# EasyEDA schematic glowstick_schematic.json
TITLE: Sheet_1; REV: 1.0; Date: 2022-10-23; Sheet: 1/1; Drawn By: robert.f.dougherty; Company: Your Company
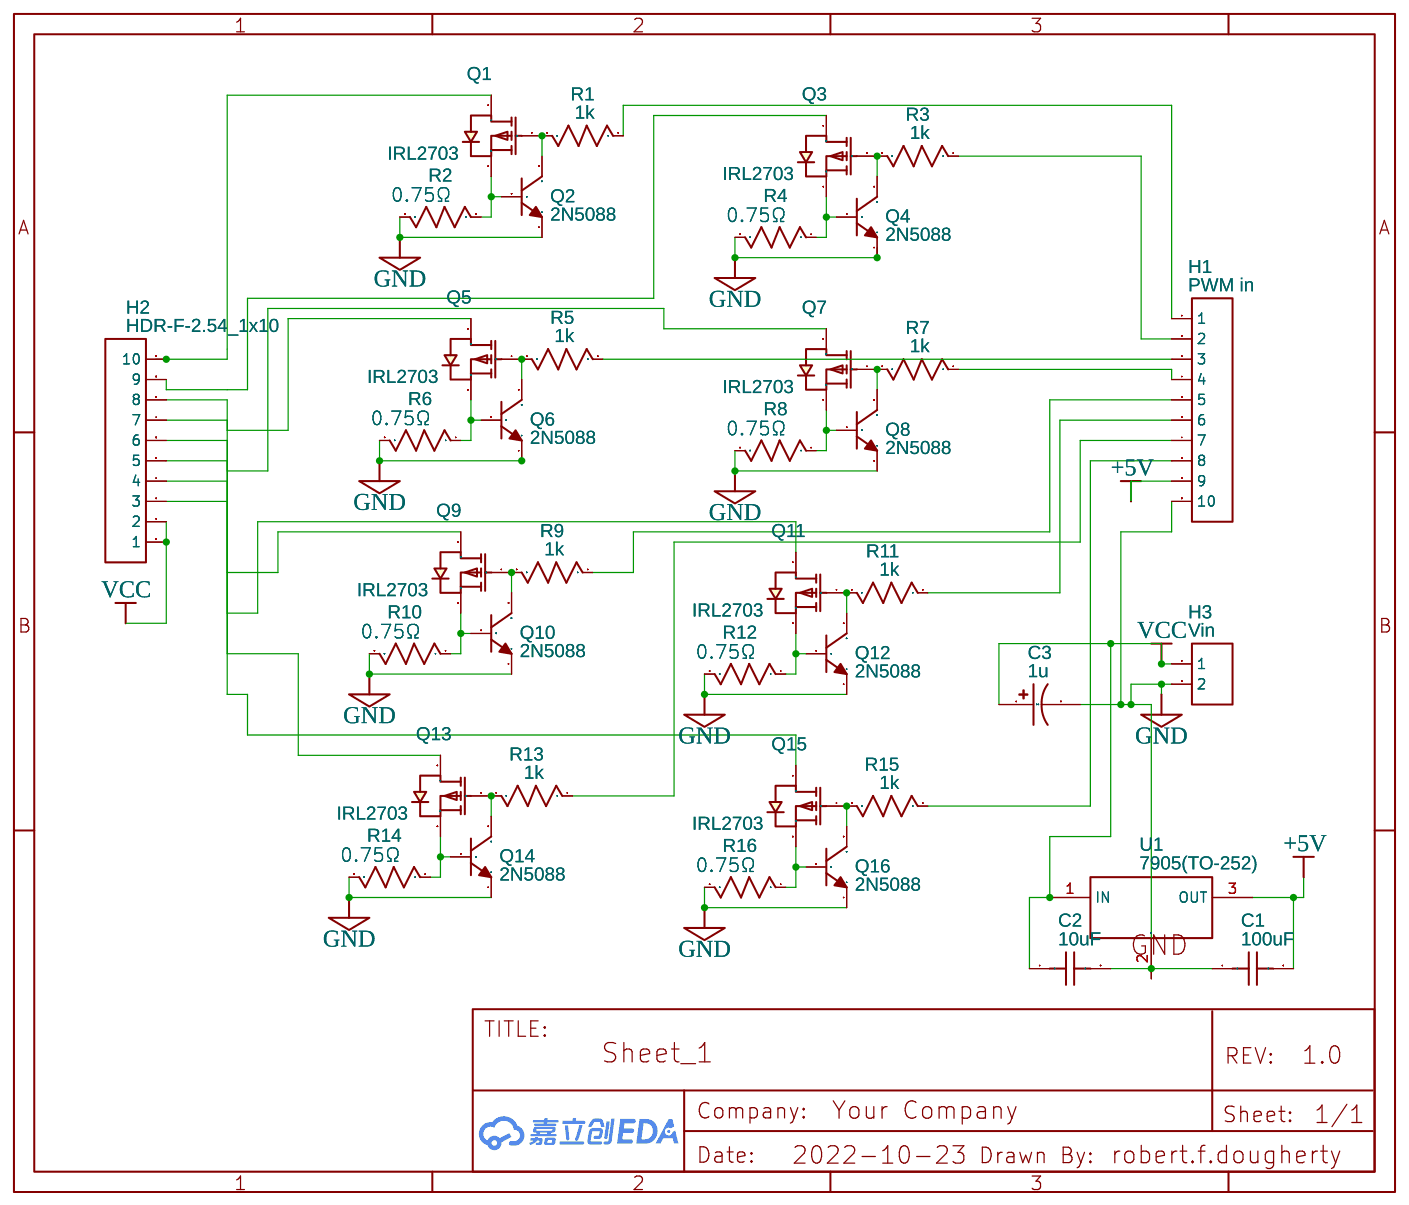
[diagram p0: schematic sheet]

## Parts
C1  100uF  [CAP-TH_L3.8-W3.8-P2.54-D0.5]
C2  10uF  [CAP-TH_L3.8-W3.8-P2.54-D0.5]
C3  1u  [CAP-D10.0×F5.0]
H1  PWM in  [HDR-F-2.54_1X10]
H2  HDR-F-2.54_1x10  [HDR-F-2.54_1X10]
H3  Vin  [MORS_2P]
Q1  IRL2703  [TO-220-3_L9.9-W4.5-P2.54-L-1]
Q2  2N5088  [S8050D]
Q3  IRL2703  [TO-220-3_L9.9-W4.5-P2.54-L-1]
Q4  2N5088  [S8050D]
Q5  IRL2703  [TO-220-3_L9.9-W4.5-P2.54-L-1]
Q6  2N5088  [S8050D]
Q7  IRL2703  [TO-220-3_L9.9-W4.5-P2.54-L-1]
Q8  2N5088  [S8050D]
Q9  IRL2703  [TO-220-3_L9.9-W4.5-P2.54-L-1]
Q10  2N5088  [S8050D]
Q11  IRL2703  [TO-220-3_L9.9-W4.5-P2.54-L-1]
Q12  2N5088  [S8050D]
Q13  IRL2703  [TO-220-3_L9.9-W4.5-P2.54-L-1]
Q14  2N5088  [S8050D]
Q15  IRL2703  [TO-220-3_L9.9-W4.5-P2.54-L-1]
Q16  2N5088  [S8050D]
R1  1k  [RD-3.2X1.8-1/8W]
R2  0.75Ω  [AXIAL-6.5X2.3(1/2WS)]
R3  1k  [RD-3.2X1.8-1/8W]
R4  0.75Ω  [AXIAL-6.5X2.3(1/2WS)]
R5  1k  [RD-3.2X1.8-1/8W]
R6  0.75Ω  [AXIAL-6.5X2.3(1/2WS)]
R7  1k  [RD-3.2X1.8-1/8W]
R8  0.75Ω  [AXIAL-6.5X2.3(1/2WS)]
R9  1k  [RD-3.2X1.8-1/8W]
R10  0.75Ω  [AXIAL-6.5X2.3(1/2WS)]
R11  1k  [RD-3.2X1.8-1/8W]
R12  0.75Ω  [AXIAL-6.5X2.3(1/2WS)]
R13  1k  [RD-3.2X1.8-1/8W]
R14  0.75Ω  [AXIAL-6.5X2.3(1/2WS)]
R15  1k  [RD-3.2X1.8-1/8W]
R16  0.75Ω  [AXIAL-6.5X2.3(1/2WS)]
U1  7905(TO-252)  [PG-TO220-3_L10.0-W4.5-P2.54-L]

## Library data of the parts
C1 C2 = C_0603_US: Contributor: LCEDA_Lib
C3 = CE_TH_D10.0×F5.0_US: Contributor: LCEDA_Lib
H1 H2 = HDR-F-2.54_1x10: Supplier Part: C35445; Supplier: LCSC; Contributor: LCEDA_Lib
H3 = HDR-F-2.54_1x2: Supplier Part: 1729128; Supplier: Digi-Key; Contributor: LCEDA_Lib
Q1 Q3 Q5 Q7 Q9 Q11 Q13 Q15 = IRF5210: Supplier: LCSC; Manufacturer: IR; Manufacturer Part: IRF5210STRLPBF; image: //image.lceda.cn/szlcsc/C2622.jpg; Supplier Part: C2622; Paste Type: expand; Contributor: LCEDA_Lib
Q2 Q4 Q6 Q8 Q10 Q12 Q14 Q16 = 2N3904(TO-92): Supplier: LCSC; Manufacturer: SEMTECH; Manufacturer Part: 2N3904; Supplier Part: C118538; Contributor: LCEDA_Lib
R1-R16 = R_0603_US: Contributor: LCEDA_Lib
U1 = 7905(TO-252): Supplier: LCSC; Manufacturer: CJ; Manufacturer Part: CJ7905; image: //image.lceda.cn/szlcsc/C78860.jpg; Supplier Part: C78860; Paste Type: expand; Contributor: LCEDA_Lib

## Nets
+5V: C1.2 H1.9 U1.3(OUT)
GND: C1.1 C2.2 C3.2 H1.10 H3.2 Q2.1(E) Q4.1(E) Q6.1(E) Q8.1(E) Q10.1(E) Q12.1(E) Q14.1(E) Q16.1(E) R2.2 R4.2 R6.2 R8.2 R10.2 R12.2 R14.2 R16.2 U1.2(GND)
VCC: C2.1 C3.1 H2.1 H2.2 H3.1 U1.1(IN)
Net-(H1-1): H1.1 R1.1
Net-(H1-2): H1.2 R3.1
Net-(H1-3): H1.3 R5.1
Net-(H1-4): H1.4 R7.1
Net-(H1-5): H1.5 R9.1
Net-(H1-6): H1.6 R11.1
Net-(H1-7): H1.7 R13.1
Net-(H1-8): H1.8 R15.1
Net-(H2-3): H2.3 Q15.2(D)
Net-(H2-4): H2.4 Q13.2(D)
Net-(H2-5): H2.5 Q11.2(D)
Net-(H2-6): H2.6 Q9.2(D)
Net-(H2-7): H2.7 Q7.2(D)
Net-(H2-8): H2.8 Q5.2(D)
Net-(H2-9): H2.9 Q3.2(D)
Net-(H2-10): H2.10 Q1.2(D)
Net-(Q1-1): Q1.1(G) Q2.3(C) R1.2
Net-(Q1-3): Q1.3(S) Q2.2(B) R2.1
Net-(Q3-1): Q3.1(G) Q4.3(C) R3.2
Net-(Q3-3): Q3.3(S) Q4.2(B) R4.1
Net-(Q5-1): Q5.1(G) Q6.3(C) R5.2
Net-(Q5-3): Q5.3(S) Q6.2(B) R6.1
Net-(Q7-1): Q7.1(G) Q8.3(C) R7.2
Net-(Q7-3): Q7.3(S) Q8.2(B) R8.1
Net-(Q9-1): Q9.1(G) Q10.3(C) R9.2
Net-(Q9-3): Q9.3(S) Q10.2(B) R10.1
Net-(Q11-1): Q11.1(G) Q12.3(C) R11.2
Net-(Q11-3): Q11.3(S) Q12.2(B) R12.1
Net-(Q13-1): Q13.1(G) Q14.3(C) R13.2
Net-(Q13-3): Q13.3(S) Q14.2(B) R14.1
Net-(Q15-1): Q15.1(G) Q16.3(C) R15.2
Net-(Q15-3): Q15.3(S) Q16.2(B) R16.1
